# EAGLE design eeZee_tiny (EAGLE 7.1.0)
DATABASE: ./../../../EAGLE/PARTSDB.TXT
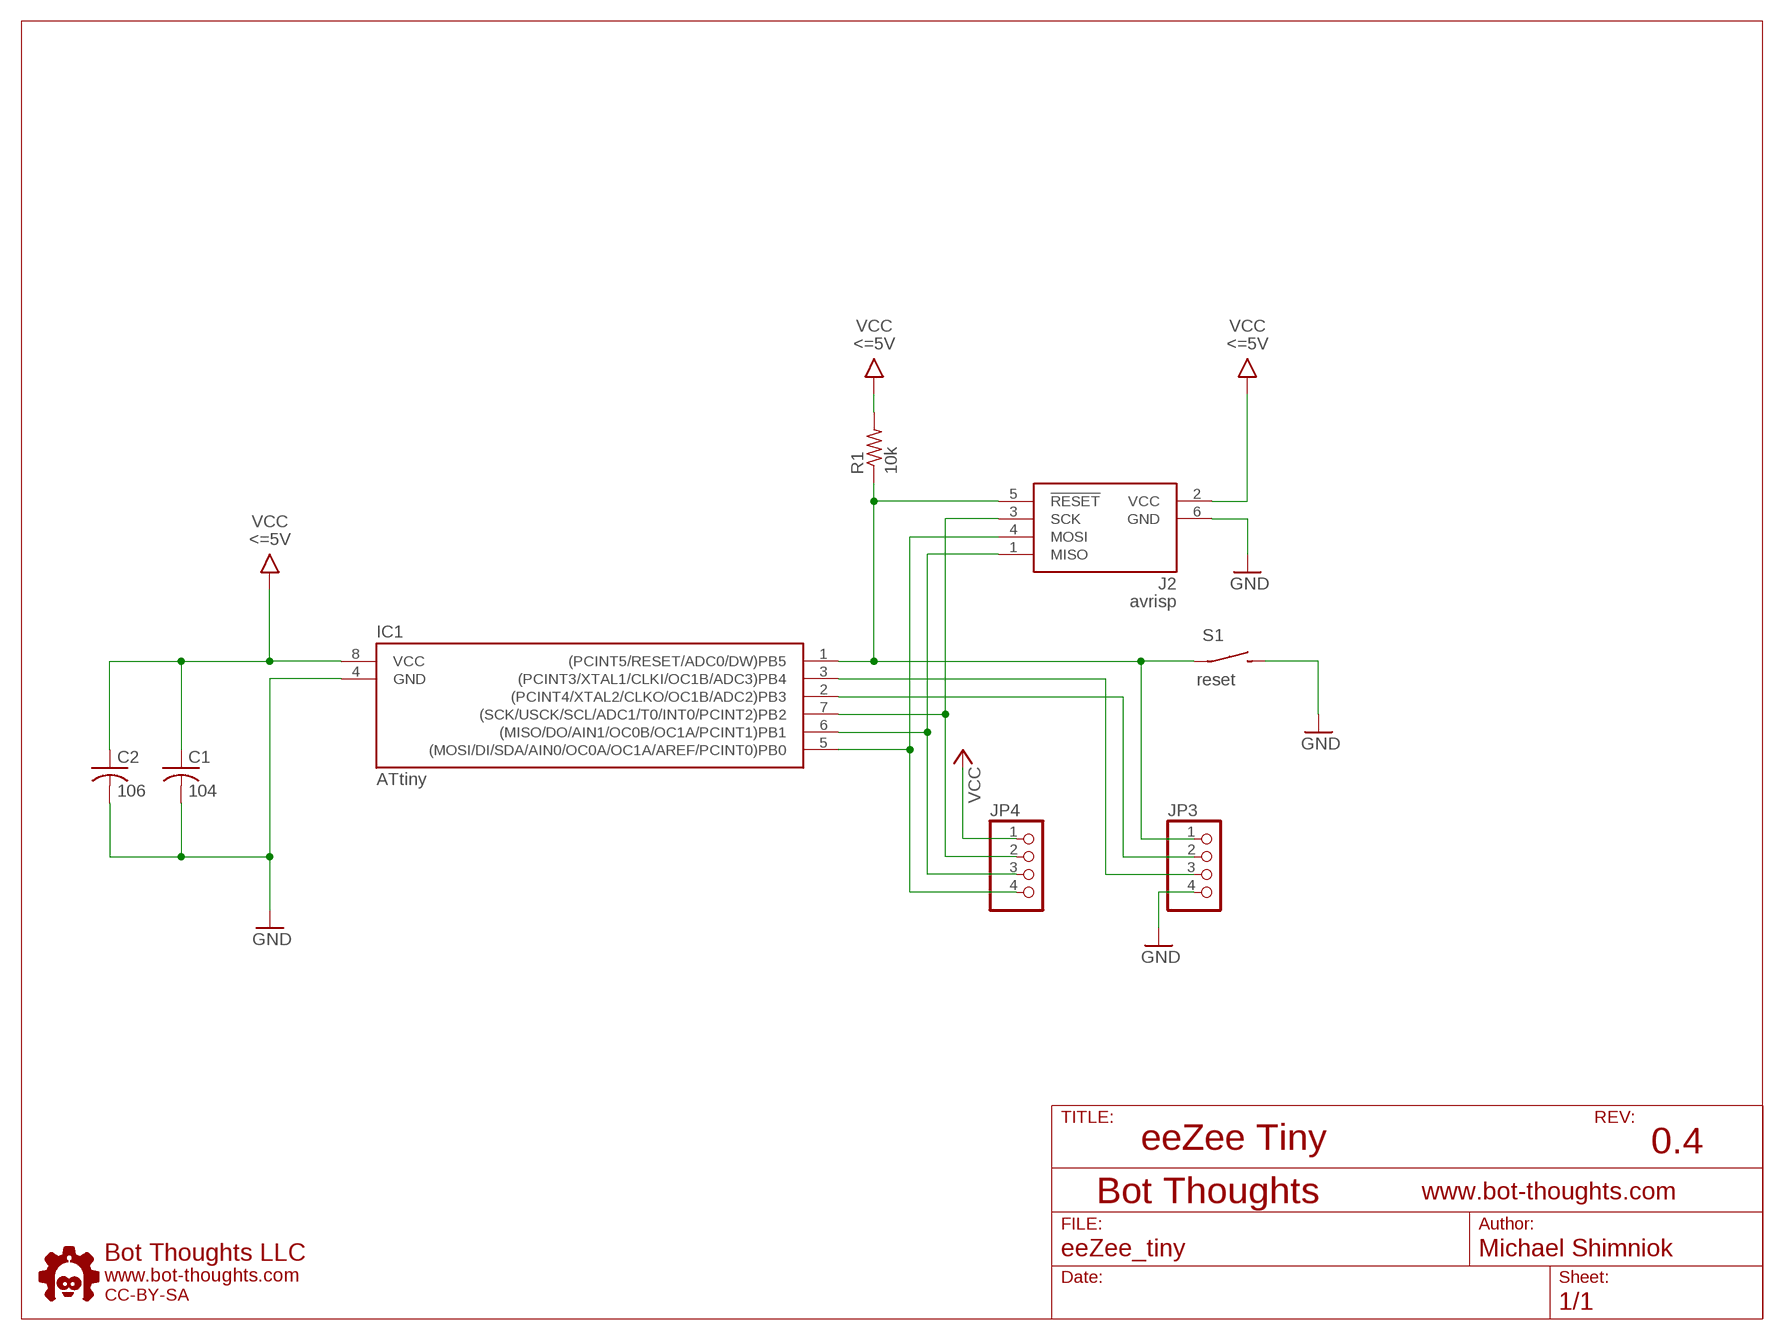
[diagram p0: schematic, sheet 1]

## Parts
C1  104  C-USC0603  [C0603]
C2  106  C-USC1206  [C1206]
IC1  ATtiny  TINY25-20PU  [DIL08]
J2  avrisp  AVRISP6_COMPACT  [CON6P2R]
JP3  PINHD-1X04_2.54-S  [1X04-S]
JP4  PINHD-1X04_2.54-S  [1X04-S]
R1  10k  R-US_R0603  [R0603]
S1  reset  SPST_TAC_RECT1  [6MMTACTILE_RECT]
U$1  BTLOGO-LOGO-MD  [BTLOGOM]

## Nets
!RESET: IC1.1((PCINT5/RESET/ADC0/DW)PB5) J2.5(!RESET) JP3.1 R1.1 S1.P$1(P)
GND: C1.2 C2.2 IC1.4(GND) J2.6(GND) JP3.4 S1.P$2(S)
MISO: IC1.6((MISO/DO/AIN1/OC0B/OC1A/PCINT1)PB1) J2.1(MISO) JP4.3
MOSI: IC1.5((MOSI/DI/SDA/AIN0/OC0A/OC1A/AREF/PCINT0)PB0) J2.4(MOSI) JP4.4
PB3: IC1.2((PCINT4/XTAL2/CLKO/OC1B/ADC2)PB3) JP3.2
PB4: IC1.3((PCINT3/XTAL1/CLKI/OC1B/ADC3)PB4) JP3.3
SCK: IC1.7((SCK/USCK/SCL/ADC1/T0/INT0/PCINT2)PB2) J2.3(SCK) JP4.2
VCC: C1.1 C2.1 IC1.8(VCC) J2.2(VCC) JP4.1 R1.2 ; supply symbol labelled <=5V

## Notes on the sheet
- eeZee Tiny | 0.4

## Library data of the parts
C1 = rcl:C-US: CAPACITOR, American symbol; BOM: EXCLUDE; PARTNO: 0603YC104KAT2A
C2 = rcl:C-US: CAPACITOR, American symbol; BOM: INCLUDE; PARTNO: F930J107MBA
IC1 = bt_avr:TINY25: Atmel AVR ATiny25,45,85 8-bit Microcontroller.
J2 = bt_avr:AVRISP6: 6-pin dual-row connector for Atmel AVRISP programmer interface
JP3 JP4 = pinhead-2:PINHD-1X04: PIN HEADER
R1 = rcl:R-US_: RESISTOR, American symbol; PARTNO: ERJ-3GEYJ103V
S1 = mes_electromech:SPST: SPST SWITCH
U$1 = bt:BTLOGO: Bot Thoughts Logo

## Board
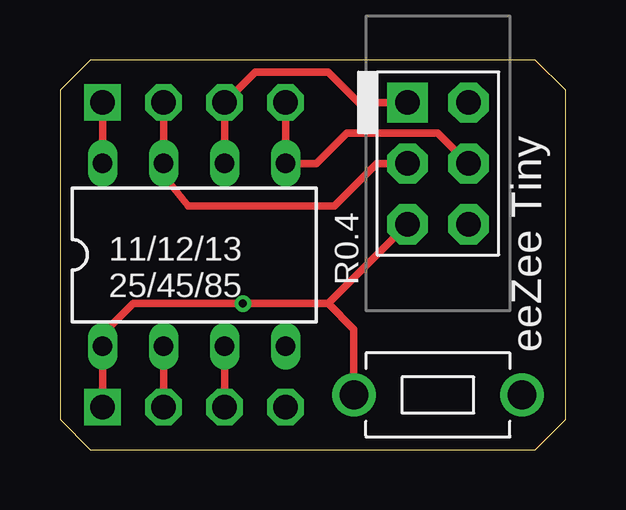
[diagram p1: board, top side]
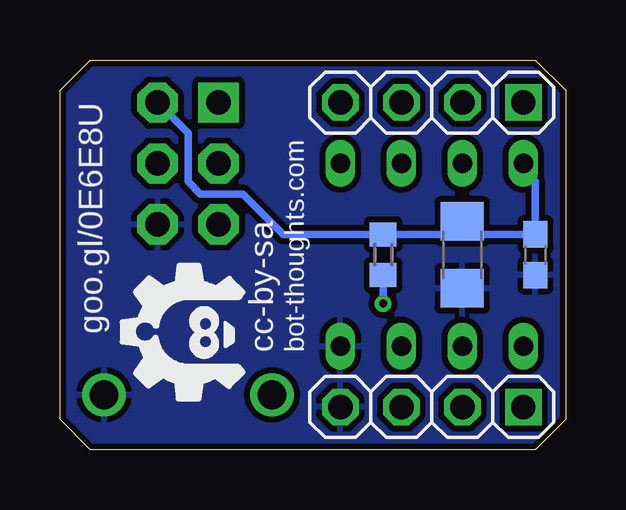
[diagram p2: board, bottom side, seen from below]

Size 21.08 x 16.26 mm. Coordinates in mm from the lower left corner, seen from the top.
Outline: 0,14.99 0,1.27 1.27,0 19.81,0 21.08,1.27 21.08,14.99 19.81,16.26 1.27,16.26 0,14.99
Copper layers (1*16): Top 0.0356mm / dielectric 1.5011mm / Bottom 0.0356mm
Design rules "LaenPCBOrder *": minimum track width 6mil, minimum drill 13mil, track to track 10mil, track to pad 10mil, pad to pad 10mil, via to via 10mil, smd to smd 8mil, copper to edge 10mil, drill to drill 10mil, minimum pad ring 7mil, minimum via ring 7mil, stop-mask expansion 3mil, vias tented up to drill 20mil, thermal gap 10mil

### Footprints (pad centres in the part's own frame; a part is rotated, then mirrored left to right if it is on the bottom)
C0603 = smd 1.1 x 1: 1 -0.85,0; 2 0.85,0
C1206 = smd 1.6 x 1.8: 1 -1.4,0; 2 1.4,0
DIL08 = drill 0.813 long: 1 -3.81,-3.81; 2 -1.27,-3.81; 3 1.27,-3.81; 4 3.81,-3.81; 5 3.81,3.81; 6 1.27,3.81; 7 -1.27,3.81; 8 -3.81,3.81
CON6P2R = drill 1.016 pad 1.676 square: 1 -2.54,-1.27 | drill 1.016 pad 1.676 octagon: 2 -2.54,1.27; 3 0,-1.27; 4 0,1.27; 5 2.54,-1.27; 6 2.54,1.27
1X04-S = drill 1.016 square: 1 -3.81,0 | drill 1.016 octagon: 2 -1.27,0; 3 1.27,0; 4 3.81,0
R0603 = smd 1 x 1.1: 1 -0.85,0; 2 0.85,0
6MMTACTILE_RECT = drill 1.2: P$1 -3.5,0; P$2 3.5,0

### Placement (x,y rotation side)
C1  1.27,8.13 270 bottom
C2  4.32,8.13 270 bottom
IC1  5.59,8.13 0 top
J2  15.75,11.94 270 top
JP3  5.59,1.78 180 bottom
JP4  5.59,14.48 180 bottom
R1  7.62,8.13 90 bottom
S1  15.75,2.29 0 top
U$1  13.21,4.83 90 bottom

### Tracks (layer width: path | path; a pad name or v marks a point on that pad's centre or on a via)
!RESET  (via drill 0.33)
  Top 0.305: 11.18,6.1 v7.62,6.1 3.05,6.1 1.78,4.83 IC1.1 JP3.1 | 11.18,6.1 12.25,5.02 S1.P$1 | 11.18,6.1 J2.5
  Bottom 0.305: R1.1 v7.62,6.1
GND
  pour Bottom: 0,16.26 21.08,16.26 21.08,0 0,0
MISO
  Top 0.305: J2.1 12.45,14.48 11.18,15.75 8.13,15.75 JP4.3 IC1.6
MOSI
  Top 0.305: J2.4 15.75,13.21 11.94,13.21 10.67,11.94 IC1.5 JP4.4
PB3
  Top 0.305: IC1.2 JP3.2
PB4
  Top 0.305: IC1.3 JP3.3
SCK
  Top 0.305: J2.3 13.21,11.94 11.43,10.16 5.33,10.16 4.32,11.43 IC1.7 JP4.2
VCC
  Top 0.305: JP4.1 IC1.8
  Bottom 0.305: 4.21,9.74 C2.1 | C2.1 3.51,8.98 C1.1 1.27,11.18 1.78,11.68 IC1.8 | C2.1 4.61,8.98 R1.2 11.77,8.98 13.46,10.67 15.24,10.67 15.75,11.18 15.75,13.21 J2.2

### Text on the board
tNames: 11/12/13 | R0.4 | 25/45/85 | eeZee Tiny
bNames: goo.gl/0E6E8U | bot-thoughts.com | cc-by-sa
_tsilk: ATtiny | 11/12/13 | 25/45/85 | Rev 0.3A | reset | eeZee Tiny
_bsilk: bot-thoughts.com